# EAGLE design driver (EAGLE 9.5.1)
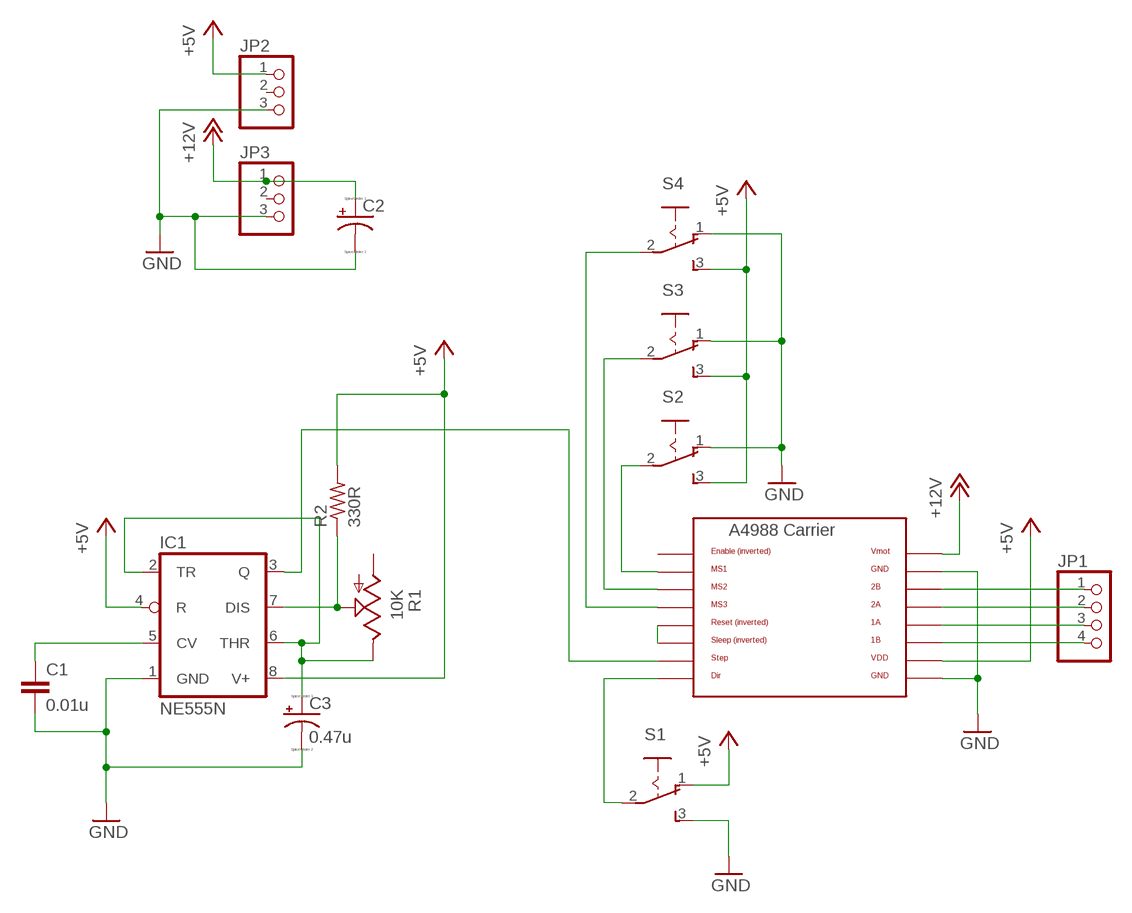
[diagram p0: schematic, sheet 1]

## Parts
C1  0.01u  C-EUC0603  [C0603]
C2  CPOL-USE5-6  [E5-6]
C3  0.47u  CPOL-USE2,5-6E  [E2,5-6E]
IC1  NE555N  [DIL08]
JP1  PINHD-1X4/90  [1X04/90]
JP2  PINHD-1X3  [1X03]
JP3  PINHD-1X3  [1X03]
R1  10K  TRIM_US-RJ9W  [RJ9W]
R2  330R  R-US_R0603  [R0603]
S1  M251  [M251]
S2  M251  [M251]
S3  M251  [M251]
S4  M251  [M251]
U$1  A4988BREAKOUT  [A4988BREAKOUT]

## Nets
+5V: IC1.4(R) IC1.8(V+) JP2.1 R2.2 S1.1(O) S2.3(S) S3.3(S) S4.3(S) U$1.VDD
+12V: C2.+ JP3.1 U$1.VMOT
GND: C1.2 C2.- C3.- IC1.1(GND) JP2.3 JP3.3 S1.3(S) S2.1(O) S3.1(O) S4.1(O) U$1.GND U$1.GND@0(GND)
N$1: S1.2(P) U$1.DIR
N$2: U$1.RST U$1.SLP(SLEEP)
N$3: S2.2(P) U$1.MS1
N$4: S3.2(P) U$1.MS2
N$5: S4.2(P) U$1.MS3
N$6: JP1.1 U$1.2B
N$7: JP1.2 U$1.2A
N$8: JP1.3 U$1.1A
N$9: JP1.4 U$1.1B
N$10: IC1.3(Q) U$1.STEP
N$11: IC1.7(DIS) R1.S R2.1
N$12: C3.+ IC1.2(TR) IC1.6(THR) R1.E
N$13: C1.1 IC1.5(CV)
Unconnected: JP2.2 JP3.2 R1.A U$1.EN

## Library data of the parts
C1 = resistor:C-EU: CAPACITOR, European symbol
C2 C3 = resistor:CPOL-US: POLARIZED CAPACITOR, American symbol
IC1 = linear:*555: TIMER
JP1 = pinhead:PINHD-1X4: PIN HEADER
JP2 JP3 = pinhead:PINHD-1X3: PIN HEADER
R1 = pot:TRIM_US-: POTENTIOMETER
R2 = resistor:R-US_: RESISTOR, American symbol
S1-S4 = switch:M251: SLIDING SWITCH Mors, distributor Buerklin, 11G702
U$1 = RepRapjr:A4988BREAKOUT

## Board
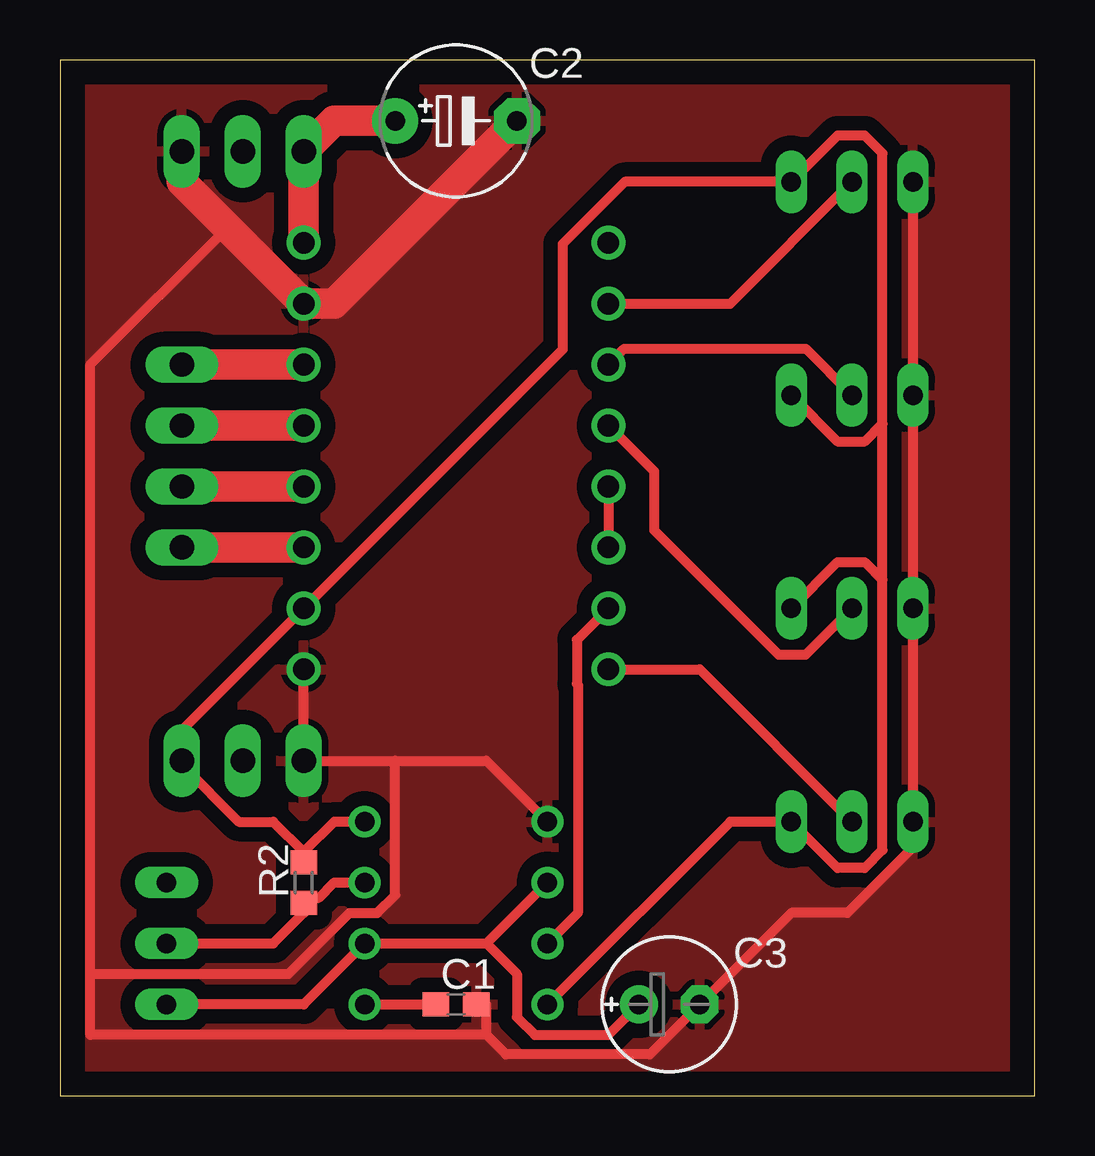
[diagram p1: board, top side]
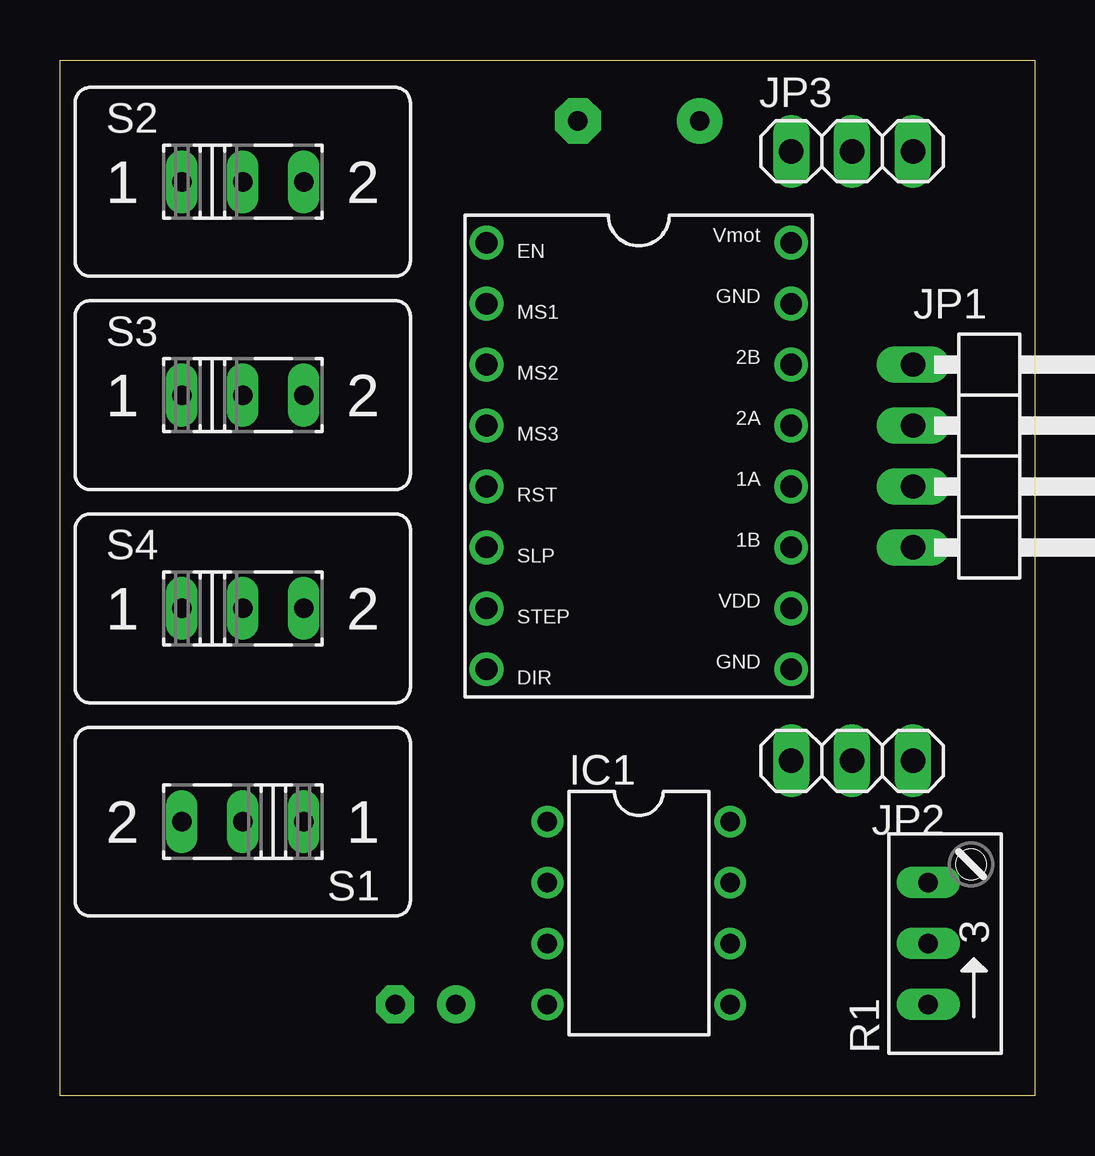
[diagram p2: board, bottom side, seen from below]

Size 40.64 x 43.18 mm. Coordinates in mm from the lower left corner, seen from the top.
Outline: 0,0 40.64,0 40.64,43.18 0,43.18 0,0
Copper layers (1*16): Top 0.035mm / dielectric 1.5mm / Bottom 0.035mm
Design rules "default *": minimum track width 16mil, minimum drill 0.4mm, track to track 16mil, track to pad 16mil, pad to pad 16mil, via to via 16mil, smd to smd 16mil, copper to edge 40mil, drill to drill 6mil, minimum pad ring 10mil, minimum via ring 8mil, stop-mask expansion 0mil, vias tented up to drill 0mil, thermal gap 10mil

### Footprints (pad centres in the part's own frame; a part is rotated, then mirrored left to right if it is on the bottom)
C0603 = smd 1.1 x 1: 1 -0.85,0; 2 0.85,0
E5-6 = drill 0.813 pad 1.905: + -2.54,0 | drill 0.813 pad 1.905 octagon: - 2.54,0
E2,5-6E = drill 0.813 pad 1.575: + -1.27,0 | drill 0.813 pad 1.575 octagon: - 1.27,0
DIL08 = drill 0.813 pad 1.27: 1 -3.81,-3.81; 2 -1.27,-3.81; 3 1.27,-3.81; 4 3.81,-3.81; 5 3.81,3.81; 6 1.27,3.81; 7 -1.27,3.81; 8 -3.81,3.81
1X04/90 = drill 1.016 long: 1 -3.81,-3.81; 2 -1.27,-3.81; 3 1.27,-3.81; 4 3.81,-3.81
1X03 = drill 1.016 long: 1 -2.54,0; 2 0,0; 3 2.54,0
RJ9W = drill 0.813 long: A 2.54,0.635; E -2.54,0.635; S 0,0.635
R0603 = smd 1 x 1.1: 1 -0.85,0; 2 0.85,0
M251 = drill 0.813 long: 1 -2.54,0; 2 0,0; 3 2.54,0
A4988BREAKOUT = drill 0.9: 1A 8.89,1.27; 1B 11.43,1.27; 2A 6.35,1.27; 2B 3.81,1.27; DIR 16.51,-11.43; EN -1.27,-11.43; GND 16.51,1.27; GND@0 1.27,1.27; MS1 1.27,-11.43; MS2 3.81,-11.43; MS3 6.35,-11.43; RST 8.89,-11.43; SLP 11.43,-11.43; STEP 13.97,-11.43; VDD 13.97,1.27; VMOT -1.27,1.27

### Placement (x,y rotation side)
C1  16.51,3.81 0 top
C2  16.51,40.64 0 top
C3  25.4,3.81 0 top
IC1  16.51,7.62 270 bottom
JP1  1.27,26.67 270 bottom
JP2  7.62,13.97 180 bottom
JP3  7.62,39.37 0 bottom
R1  3.81,6.35 90 bottom
R2  10.16,8.89 90 top
S1  33.02,11.43 180 bottom
S2  33.02,38.1 0 bottom
S3  33.02,29.21 0 bottom
S4  33.02,20.32 0 bottom
U$1  11.43,34.29 270 bottom

### Tracks (layer width: path | path; a pad name or v marks a point on that pad's centre or on a via)
+5V
  Top 0.406: IC1.4 27.94,11.43 S1.1 32.41,9.5 33.55,9.5 34.29,10.24 34.29,21.51 | 10.16,10.16 11.43,11.43 IC1.8 | 10.16,10.16 8.89,11.43 7.46,11.43 5.08,13.81 JP2.1 5.08,15.24 U$1.VDD 20.95,31.11 20.95,35.51 23.54,38.1 S2.3 32.41,40.03 33.55,40.03 34.29,39.29 34.29,28.02 | 10.16,10.16 R2.2 | 34.29,21.51 34.29,28.02 | 34.29,28.02 33.55,27.28 32.41,27.28 S3.3 | 34.29,21.51 33.55,22.25 32.41,22.25 S4.3
+12V
  Top 1.27: U$1.VMOT JP3.1 11.43,40.64 C2.+
GND
  Top 0.406: IC1.1 17.78,13.97 13.97,13.97 | 13.97,13.97 JP2.3 U$1.GND | 5.08,38.1 6.99,36.2 | 6.99,36.2 U$1.GND@0 | 17.78,2.54 17.78,3.81 C1.2 | S2.1 S3.1 S4.1 S1.3 35.56,10.36 32.82,7.62 30.48,7.62 C3.- 24.59,1.73 18.59,1.73 17.78,2.54 | 6.99,36.2 1.27,30.48 1.27,5.08 | 1.27,5.08 1.27,2.54 17.78,2.54 | 1.27,5.08 9.53,5.08 12.06,7.62 13.23,7.62 13.97,8.36 13.97,13.97
  Top 1.27: C2.- 11.43,33.02 U$1.GND@0 5.08,38.1 JP3.3
  pour Top (isolate 0.61): -2.54,45.72 -2.54,-2.54 43.18,-2.54 43.18,45.72
N$1
  Top 0.406: S1.2 26.67,17.78 U$1.DIR
N$2
  Top 0.406: U$1.RST U$1.SLP
N$3
  Top 0.406: S2.2 27.94,33.02 U$1.MS1
N$4
  Top 0.406: U$1.MS2 23.52,31.14 31.09,31.14 S3.2
N$5
  Top 0.406: U$1.MS3 24.77,26.04 24.77,23.58 29.95,18.39 31.09,18.39 S4.2
N$6
  Top 1.27: JP1.1 U$1.2B
N$7
  Top 1.27: JP1.2 U$1.2A
N$8
  Top 1.27: JP1.3 U$1.1A
N$9
  Top 1.27: JP1.4 U$1.1B
N$10
  Top 0.406: IC1.3 21.59,7.62 21.59,17.14 21.55,17.19 21.55,19.01 U$1.STEP
N$11
  Top 0.406: R1.S 8.89,6.35 10.16,7.62 R2.1 10.38,8.26 10.79,8.26 11.43,8.89 IC1.7
N$12
  Top 0.406: R1.E 10.16,3.81 IC1.6 17.78,6.35 | 17.78,6.35 IC1.2 | C3.+ 22.86,2.54 19.79,2.54 19.05,3.28 19.05,5.08 17.78,6.35
N$13
  Top 0.406: IC1.5 C1.1